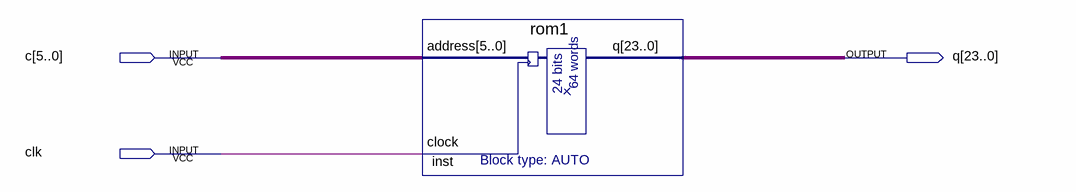
[diagram p0: schematic sheet]
// Quartus schematic 7.bdf as structural Verilog: 1 symbols, 3 pins
module \7  (
  input  [5:0] c,
  input  clk,
  output [23:0] q
);

  rom1 inst (.address(c), .clock(clk), .q(q));
endmodule
